# EAGLE design V-00724-00 (EAGLE 7.2.0)
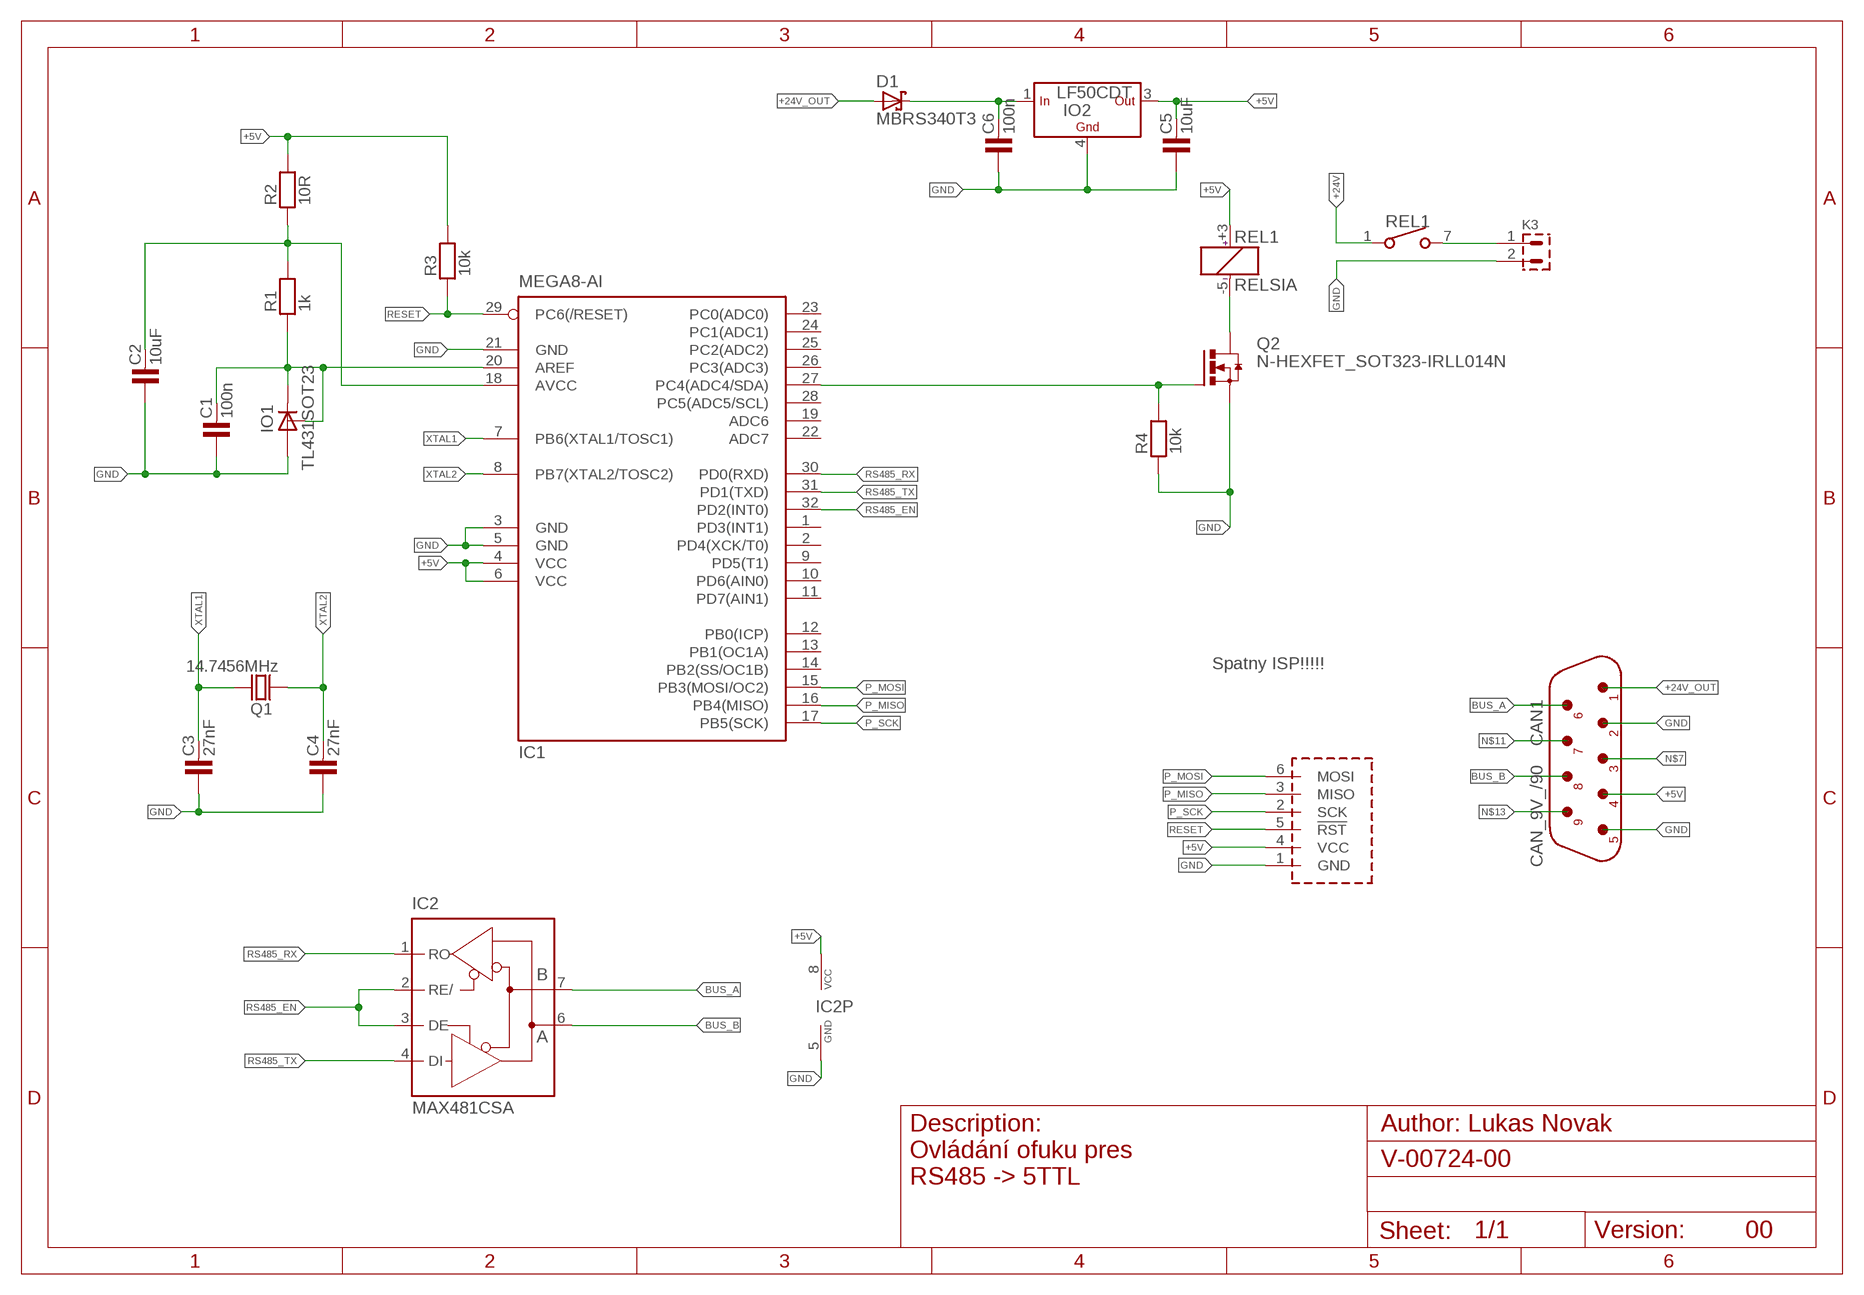
[diagram p0: schematic, sheet 1]

## Parts
C1  100n  C-KER_1206  [1206]
C2  10uF  C-KER_1206  [1206]
C3  27nF  C-KER_0805  [0805]
C4  27nF  C-KER_0805  [0805]
C5  10uF  C-KER_1206  [1206]
C6  100n  C-KER_1206  [1206]
CAN1  CAN_9V_/90  [CAN9V/90]
D1  MBRS340T3  [SMC]
IC1  MEGA8-AI  [TQFP32-08]
IC2  MAX481CSA  [SO08]
IO1  TL431SOT23  [SOT23]
IO2  LF50CDT  LF_CDT  [DPAK]
K3  PSH02-02P  [PSH02-02P]
Q1  14.7456MHz  Q_HC-49U  [HC-49U]
Q2  N-HEXFET_SOT323-IRLL014N  [SOT223]
R1  1k  R_1206  [1206]
R2  10R  R_1206  [1206]
R3  10k  R_1206  [1206]
R4  10k  R_1206  [1206]
REL1  RELSIA  [RELSIA]
U$1  AVR_PROG_SPI  [PSH02-06P]

## Nets
+5V: C5.2 CAN1.4 IC1.4(VCC) IC1.6(VCC) IC2.8(VCC) IO2.3(OUT) R2.2 R3.2 REL1.+3(CIVKA:C+) U$1.4(VCC)
+24V: C6.2 D1.C IO2.1(IN) REL1.1
+24V_OUT: CAN1.1 D1.A
BUS_A: CAN1.6 IC2.7(B)
BUS_B: CAN1.8 IC2.6(A)
GND: C1.1 C2.1 C3.1 C4.1 C5.1 C6.1 CAN1.2 CAN1.5 IC1.3(GND) IC1.5(GND) IC1.21(GND) IC2.5(GND) IO1.3(A) IO2.4(GND) K3.2 Q2.3(S) R4.1 U$1.1(GND)
N$1: C1.2 IC1.20(AREF) IO1.1(C) IO1.2(R) R1.1
N$6: C2.2 IC1.18(AVCC) R1.2 R2.1
N$7: CAN1.3
N$11: CAN1.7
N$13: CAN1.9
N$21: IC1.27(PC4(ADC4/SDA)) Q2.1(G) R4.2
N$24: Q2.4(D) REL1.-5(CIVKA:C-)
N$27: K3.1 REL1.7
P_MISO: IC1.16(PB4(MISO)) U$1.3(MISO)
P_MOSI: IC1.15(PB3(MOSI/OC2)) U$1.6(MOSI)
P_SCK: IC1.17(PB5(SCK)) U$1.2(SCK)
RESET: IC1.29(PC6(/RESET)) R3.1 U$1.5(!RST)
RS485_EN: IC1.32(PD2(INT0)) IC2.2(RE/) IC2.3(DE)
RS485_RX: IC1.30(PD0(RXD)) IC2.1(RO)
RS485_TX: IC1.31(PD1(TXD)) IC2.4(DI)
XTAL1: C3.2 IC1.7(PB6(XTAL1/TOSC1)) Q1.2
XTAL2: C4.2 IC1.8(PB7(XTAL2/TOSC2)) Q1.1
Unconnected: IC1.1(PD3(INT1)) IC1.2(PD4(XCK/T0)) IC1.9(PD5(T1)) IC1.10(PD6(AIN0)) IC1.11(PD7(AIN1)) IC1.12(PB0(ICP)) IC1.13(PB1(OC1A)) IC1.14(PB2(SS/OC1B)) IC1.19(ADC6) IC1.22(ADC7) IC1.23(PC0(ADC0)) IC1.24(PC1(ADC1)) IC1.25(PC2(ADC2)) IC1.26(PC3(ADC3)) IC1.28(PC5(ADC5/SCL))

## Notes on the sheet
- Spatny ISP!!!!!
- Ovládání ofuku pres
  RS485 -> 5TTL
- 00

## Library data of the parts
C1-C6 = #PaJa_31:C-KER: Kondenzator - keramicky
CAN1 = #PaJa_konektory:CAN_9V: Konektory CANNON - vidlice - 9pinu
D1 = diode:MBRS3*0T3: SCHOTTKY BARRIER RECTIFIER 3.0 AMPERES 20, 30, 40 VOLT Source: MBRS340T3-D.pdf
IC1 = atmel:MEGA8: MICROCONTROLLER 8 Kbytes FLASH, 1 kbytes SRAM, 512 bytes EEPROM, USART, 6-channel 10 bit ADC, 2-channel 8 bit ADC Pin compatible with Atmega48, ATMega88, ATMega168 Source: avr.lbr; MPN: ATMEGA8-16AU; OC_FARNELL: 9171371; OC_NEWARK: 73M8863
IC2 = maxim:MAX481CSA: RS485 TRANSEIVER; MF: MAXIM; MPN: MAX481CSA; OC_FARNELL: unknown; OC_NEWARK: 90C3817
IO1 = references:TL431: Programmable Shunt Regulator TL431 Features > Programmable Output Voltage to 36 Volts > Low Dynamic Output Impedance 0.2? Typical > Sink Current Capability of 1.0 to 100mA > Equivalent Full-Range Temperature Coefficient of 50ppm/°C Typical > Temperature Compensated For Operation Over Full Rated Operating Temperature Range > Low Output Noise Voltage > Fast Turn-on Response; MPN: TL431BFDT; OC_FARNELL: 2095471; PACKAGE: SOT23; SUPPLIER: NXP
IO2 = #PaJa_31:LF_C: LF??C - stabilizatory low-drop Out= 1,5 / 1,8 / 2,5 / 3,3 / 4,7 / 5 / 6 / 8 / 5,5 / 9 / 12 V Avaiable in +- 1% (AB) , +- 2% (C)
K3 = #PaJa_konektory:PSH02-02: Konektory se zamkem - vidlice - 2pin
Q1 = #PaJa_31:Q: Krystal HC-49 - 1MHz - 48MHz DT38 - Quartz (hodinovy) 32,768kHz
Q2 = transistor-power:N-HEXFET_?-*: HEXFET® Power MOSFET
R1-R4 = #PaJa_31:R: Rezistor
REL1 = #PaJa_31:RELSIA??: RELE - 1x spinaci, 5V, 12V, 24V max. spinany proud = 0,5A
U$1 = #PaJa_konektory:AVR_PROG_SPI

## Board
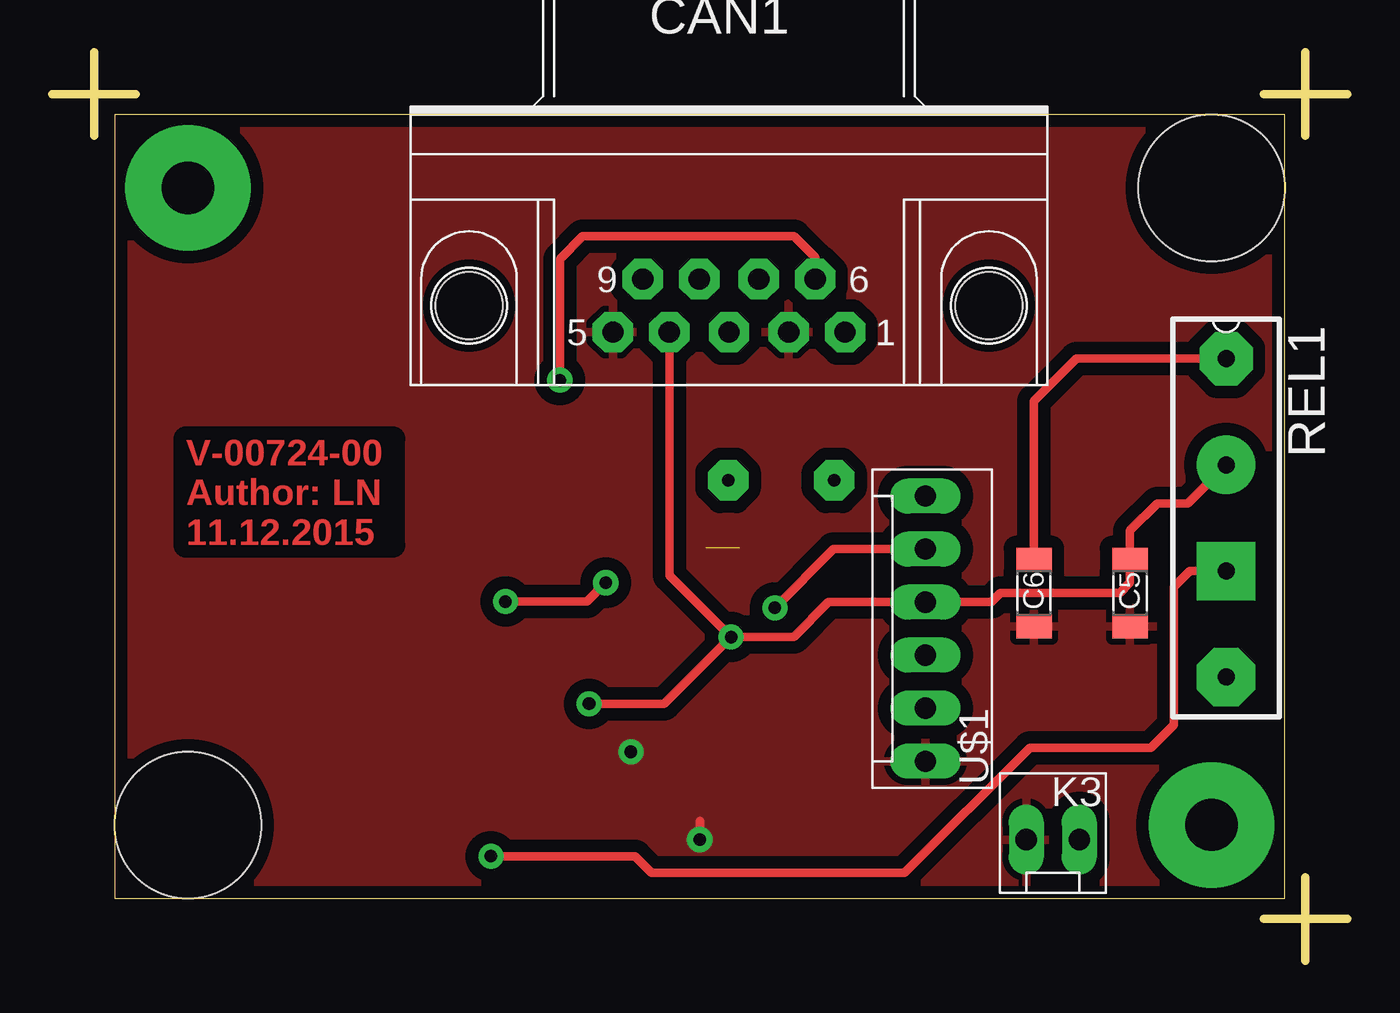
[diagram p1: board, top side]
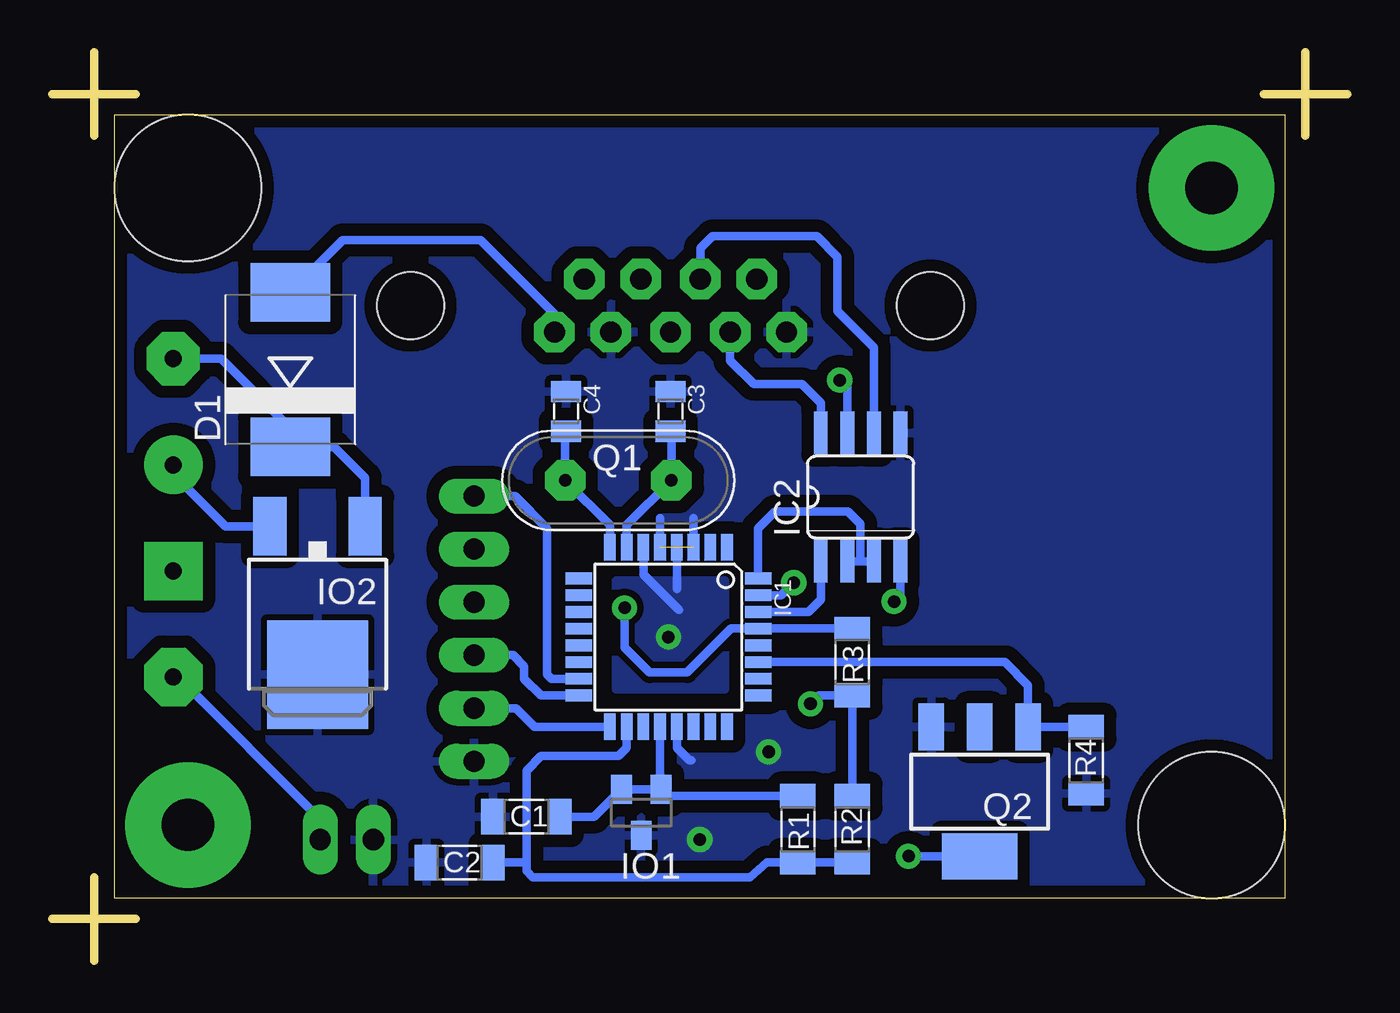
[diagram p2: board, bottom side, seen from below]

Size 62 x 43.5 mm. Coordinates in mm from the lower left corner, seen from the top.
Outline: 0,41.5 4,41.5
Outline: 2,39.5 2,43.5
Outline: 58,41.5 62,41.5
Outline: 60,39.5 60,43.5
Outline: 58,2 62,2
Outline: 60,0 60,4
Outline: 3,3 59,3 59,40.5 3,40.5 3,3
Copper layers (1*16): Top 0.04mm / dielectric 1.5mm / Bottom 0.04mm
Design rules "mucha_navrh *": minimum track width 0.2mm, minimum drill 0.6mm, track to track 0.3mm, track to pad 0.3mm, pad to pad 0.3mm, via to via 0.3mm, smd to smd 0mil, copper to edge 0.6mm, drill to drill 0.5mm, minimum pad ring 0.3mm, minimum via ring 0.3mm, stop-mask expansion 0.1mm, vias tented up to drill 0.8mm, thermal gap 0.3mm
Holes 7 mm at 6.5,6.5 55.5,37

### Footprints (pad centres in the part's own frame; a part is rotated, then mirrored left to right if it is on the bottom)
1206 = smd 1.143 x 1.702: 1 -1.587,0; 2 1.587,0
0805 = smd 1.016 x 1.422: 1 -0.953,0; 2 0.953,0
CAN9V/90 = drill 1.016 pad 1.93 octagon: 1 5.556,0; 2 2.857,0; 3 0,0; 4 -2.857,0; 5 -5.556,0; 6 4.128,2.54; 7 1.429,2.54; 8 -1.429,2.54; 9 -4.128,2.54 | hole 3.2: 12.446,1.27; -12.446,1.27
SMC = smd 2.8 x 3.8: A 3.7,0; C -3.7,0
TQFP32-08 = smd 1.27 x 0.559: 1 -4.293,2.8; 2 -4.293,2; 3 -4.293,1.2; 4 -4.293,0.4; 5 -4.293,-0.4; 6 -4.293,-1.2; 7 -4.293,-2; 8 -4.293,-2.8; 17 4.293,-2.8; 18 4.293,-2; 19 4.293,-1.2; 20 4.293,-0.4; 21 4.293,0.4; 22 4.293,1.2; 23 4.293,2; 24 4.293,2.8 | smd 0.559 x 1.27: 9 -2.8,-4.293; 10 -2,-4.293; 11 -1.2,-4.293; 12 -0.4,-4.293; 13 0.4,-4.293; 14 1.2,-4.293; 15 2,-4.293; 16 2.8,-4.293; 25 2.8,4.293; 26 2,4.293; 27 1.2,4.293; 28 0.4,4.293; 29 -0.4,4.293; 30 -1.2,4.293; 31 -2,4.293; 32 -2.8,4.293
SO08 = smd 0.66 x 2.032: 1 -1.905,-3.073; 2 -0.635,-3.073; 3 0.635,-3.073; 4 1.905,-3.073; 5 1.905,3.073; 6 0.635,3.073; 7 -0.635,3.073; 8 -1.905,3.073
SOT23 = smd 1 x 1.4: 1 -0.95,-1.1; 2 0.95,-1.1; 3 0,1.1
DPAK = smd 1.6 x 2.8: 1 -2.28,-4.992; 3 2.28,-4.992 | smd 4.826 x 5.191: 4 0,2.096
PSH02-02P = drill 1.016 pad 1.422 long: 1 -1.27,0; 2 1.27,0
HC-49U = drill 0.61 pad 1.93 octagon: 1 -2.54,0; 2 2.54,0
SOT223 = smd 1.219 x 2.235: 1 -2.311,-3.099; 2 0,-3.099; 3 2.311,-3.099 | smd 3.6 x 2.2: 4 0,3.099
RELSIA = drill 0.813 pad 2.54 octagon: 1 -7.62,0 | drill 0.813 pad 2.8 octagon: 7 7.62,0 | drill 0.813 pad 2.8: +3 -2.54,0 | drill 0.813 pad 2.8 square: -5 2.54,0
PSH02-06P = drill 1.016 pad 1.422 long: 1 -6.35,0; 2 -3.81,0; 3 -1.27,0; 4 1.27,0; 5 3.81,0; 6 6.35,0

### Placement (x,y rotation side)
C1  39.3,6.9 0 bottom
C2  42.5,4.7 0 bottom
C3  32.4,26.3 270 bottom
C4  37.4,26.3 270 bottom
C5  51.6,17.6 90 top
C6  47,17.6 90 top
CAN1  32.4,30.1 0 top
D1  50.6,28.3 90 bottom
IC1  32.5,15.5 270 bottom
IC2  23.3,22.2 0 bottom
IO1  33.8,7.1 180 bottom
IO2  49.3,15.8 180 bottom
K3  47.9,5.8 180 top
Q1  34.9,23 0 bottom
Q2  17.6,8.1 180 bottom
R1  26.3,6.3 270 bottom
R2  23.7,6.3 90 bottom
R3  23.7,14.3 270 bottom
R4  12.5,9.6 90 bottom
REL1  RELSIA?  [RELSIA]  56.2,21.2 270 top
U$1  41.8,15.9 90 top

### Tracks (layer width: path | path; a pad name or v marks a point on that pad's centre or on a via)
+5V  (via drill 0.6)
  Top 0.406: REL1.+3 54.36,21.9 52.9,21.9 51.6,20.6 C5.2 51.6,18.1 51.1,17.6 45.4,17.6 44.97,17.17 U$1.4 37.17,17.17 35.5,15.5 v32.5,15.5 | CAN1.4 29.54,18.46 v32.5,15.5 | v25.7,12.3 29.3,12.3 v32.5,15.5
  Bottom 0.406: IC2.8 25.2,26.7 26.1,27.6 28.4,27.6 29.54,28.74 CAN1.4 | IC1.4 32.1,17.8 | IO2.3 53.69,20.79 56.2,23.3 REL1.+3 | R2.2 R3.2 25.29,12.71 v25.7,12.3 | IC1.6 33.7,18.5 32,16.8
  pour Bottom (rank 5): 29.8,18.2 35,18.2 35,13 29.8,13
+24V
  Top 0.406: C6.2 47,26.8 49.02,28.82 REL1.1
  Bottom 0.406: REL1.1 53.92,28.82 50.6,25.5 D1.C 48.5,24.6 47.02,23.12 IO2.1
+24V_OUT
  Bottom 0.406: CAN1.1 37.96,30.96 41.5,34.5 48.1,34.5 D1.A
BUS_A  (via drill 0.6)
  Top 0.406: v24.3,27.8 24.3,33.6 25.4,34.7 35.5,34.7 36.53,33.67 CAN1.6
  Bottom 0.406: IC2.7 23.93,27.43 v24.3,27.8
BUS_B
  Bottom 0.406: IC2.6 22.66,29.36 24.4,31.1 24.4,33.7 25.4,34.7 30.4,34.7 30.97,34.13 CAN1.8
GND  (via drill 0.6)  (1 unrouted)
  Top 0.406: v31,5.8 31,6.7
  Bottom 0.406: IC1.3 31.3,21.2 | IC1.5 32.9,21.2 | IC1.21 32.1,10.2 31.5,9.6 31.4,9.6
  other vias: 27.7,10
  pour Bottom (isolate 0.6, rank 6): 3,3 59,3 59,40.5 3,40.5
  pour Top (isolate 0.6, rank 6): 3,3 59,3 59,40.5 3,40.5
N$1
  Bottom 0.406: R1.1 32.54,7.89 IO1.1 | IC1.20 32.9,8.25 IO1.1 | IO1.1 IO1.2 36.05,6.9 C1.2
N$2  (via drill 2.5 pad 6)
  other vias: 6.5,37
N$5  (via drill 2.5 pad 6)
  other vias: 55.5,6.5
N$6
  Bottom 0.406: R2.1 R1.2 27.79,4.71 28.6,4 39,4 39.3,4.3 39.3,4.6 | IC1.18 34.5,10.2 34.9,9.8 38.6,9.8 39.3,9.1 39.3,4.6 | C2.2 39.4,4.7 39.3,4.6
N$21
  Bottom 0.406: IC1.27 16.4,14.3 15.29,13.19 Q2.1 R4.2
N$24  (via drill 0.6)
  Top 0.406: v21,5 27.9,5 28.7,4.2 40.8,4.2 46.8,10.2 52,10.2 52.4,10.2 52.6,10.2 53.7,11.3 53.7,17.9 54.46,18.66 REL1.-5
  Bottom 0.406: Q2.4 v21,5
N$27
  Bottom 0.406: REL1.7 55.98,13.58 49.17,6.77 K3.1
P_MISO
  Bottom 0.406: IC1.16 38.6,12.7 39.4,13.5 39.4,14.1 39.93,14.63 U$1.3
P_MOSI
  Bottom 0.406: IC1.15 38.1,13.5 38.3,13.7 38.3,20.7 39.85,22.25 U$1.6
P_SCK
  Bottom 0.406: IC1.17 38.91,11.21 39.79,12.09 U$1.2
RESET  (via drill 0.6)
  Top 0.406: U$1.5 37.41,19.71 v34.6,16.9
  Bottom 0.406: R3.1 23.81,15.9 IC1.29 29.5,15.9 31.6,13.8 33.4,13.8 34.6,15 v34.6,16.9
RS485_EN
  Bottom 0.406: IC1.32 28.21,20.69 27.4,21.5 23.9,21.5 23.3,20.9 23.3,19.13 | IC2.3 23.3,19.13 | 23.3,19.13 IC2.2
RS485_RX
  Bottom 0.406: IC1.30 25.8,16.7 25.2,17.3 IC2.1
RS485_TX  (via drill 0.6)
  Top 0.406: v21.7,17.2 25.6,17.2 v26.5,18.1
  Bottom 0.406: IC1.31 27.1,17.5 26.9,17.7 v26.5,18.1 | IC2.4 21.39,17.51 v21.7,17.2
XTAL1
  Bottom 0.406: IC1.7 34.5,20.86 Q1.2 32.36,25.31 C3.2
XTAL2
  Bottom 0.406: IC1.8 35.3,20.86 Q1.1 37.44,25.31 C4.2

### Text on the board
Top: V-00724-00 / Author: LN / 11.12.2015
Measures: 56.00 | 49.00 | 37.5 | 30.50